# Altium schematic sheet MCU.SchDoc: 分区电源管理电路板-MCU
size A4; Organization: 智能实训室产品部; Address1: 广东省深圳市; Address2: 宝安区石岩凯普达工业园; DocumentNumber: 190416; Revision: V1.0; SheetNumber: 5; SheetTotal: 6; Date: 2019-4-24; ApprovedBy: 杨青; CheckedBy: 杨青; DrawnBy: 杨青; Engineer: 杨青; ProjectName_GTA: 实训室智能化管理系统; PCB Number: GS-P1B-GXO02
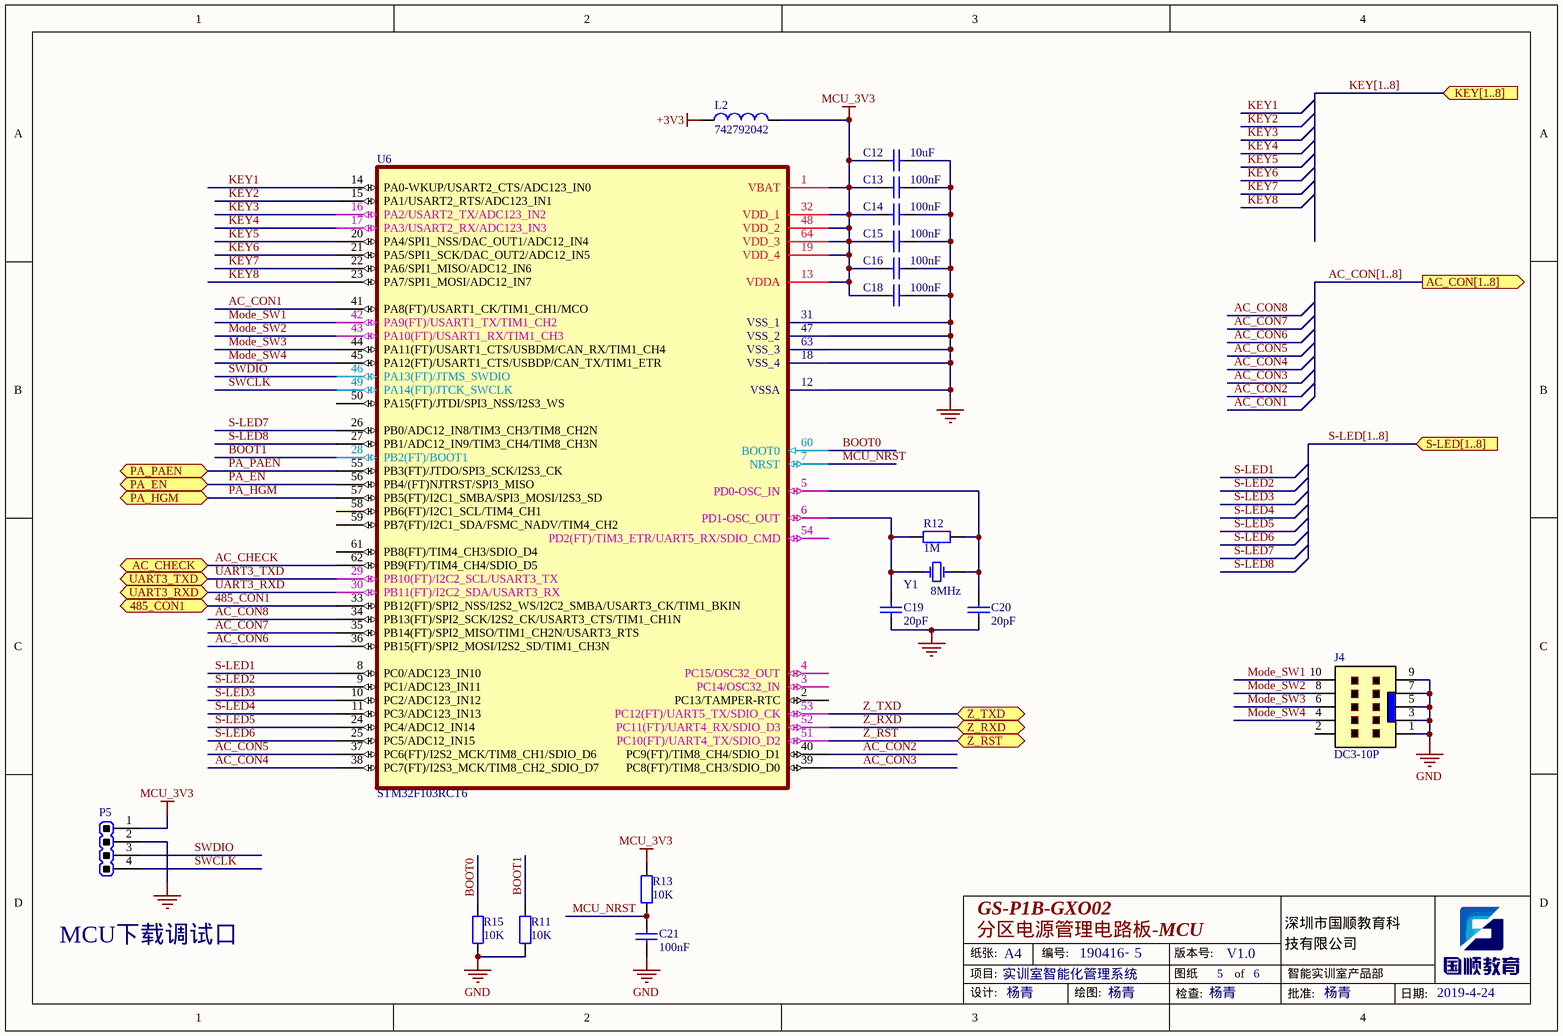
[diagram p0: MCU.SchDoc]

## Parts
C12  10uF  [C0603]
C13  100nF  [C0603]
C14  100nF  [C0603]
C15  100nF  [C0603]
C16  100nF  [C0603]
C18  100nF  [C0603]
C19  20pF  [C0603]
C20  20pF  [C0603]
C21  100nF  [C0603]
J4  DC3-10P  [DC3-2*5-2.54-M]
L2  742792042  [L0805]
P5  HDRM-2.54/11-1*4P-AK  [HDRM-2.54-1*4P-AK1]  (value not drawn)
R11  10K  [R0603]
R12  1M  [R0603]
R13  10K  [R0603]
R15  10K  [R0603]
U6  STM32F103RCT6  [LQFP64]
Y1  8MHz  [X_HC49-S]

## Ports
485_CON1 (bidir), AC_CHECK (bidir), AC_CON[1..8] (out), KEY[1..8] (in), PA_EN (bidir), PA_HGM (bidir), PA_PAEN (bidir), S-LED[1..8] (in), UART3_RXD (bidir), UART3_TXD (bidir), Z_RST (bidir), Z_RXD (bidir), Z_TXD (bidir)

## Nets
+3V3: L2.2
GND: C12.1 C13.2 C14.2 C15.1 C16.1 C18.2 C19.2 C20.2 C21.2 J4.1 J4.3 J4.5 J4.7 J4.9 P5.2 R11.1 R15.1 U6.12(VSSA) U6.18(VSS_4) U6.31(VSS_1) U6.47(VSS_2) U6.63(VSS_3)
MCU_3V3: C12.2 C13.1 C14.1 C15.2 C16.2 C18.1 L2.1 P5.1 R13.2 U6.1(VBAT) U6.13(VDDA) U6.19(VDD_4) U6.32(VDD_1) U6.48(VDD_2) U6.64(VDD_3)
485_CON1: U6.33(PB12(FT)/SPI2_NSS/I2S2_WS/I2C2_SMBA/USART3_CK/TIM1_BKIN) ; port 485_CON1
AC_CHECK: U6.62(PB9(FT)/TIM4_CH4/SDIO_D5) ; port AC_CHECK
AC_CON1: U6.41(PA8(FT)/USART1_CK/TIM1_CH1/MCO)
AC_CON2: U6.40(PC9(FT)/TIM8_CH4/SDIO_D1)
AC_CON3: U6.39(PC8(FT)/TIM8_CH3/SDIO_D0)
AC_CON4: U6.38(PC7(FT)/I2S3_MCK/TIM8_CH2_SDIO_D7)
AC_CON5: U6.37(PC6(FT)/I2S2_MCK/TIM8_CH1/SDIO_D6)
AC_CON6: U6.36(PB15(FT)/SPI2_MOSI/I2S2_SD/TIM1_CH3N)
AC_CON7: U6.35(PB14(FT)/SPI2_MISO/TIM1_CH2N/USART3_RTS)
AC_CON8: U6.34(PB13(FT)/SPI2_SCK/I2S2_CK/USART3_CTS/TIM1_CH1N)
BOOT0: R15.2 U6.60(BOOT0)
BOOT1: R11.2 U6.28(PB2(FT)/BOOT1)
KEY1: U6.14(PA0-WKUP/USART2_CTS/ADC123_IN0)
KEY2: U6.15(PA1/USART2_RTS/ADC123_IN1)
KEY3: U6.16(PA2/USART2_TX/ADC123_IN2)
KEY4: U6.17(PA3/USART2_RX/ADC123_IN3)
KEY5: U6.20(PA4/SPI1_NSS/DAC_OUT1/ADC12_IN4)
KEY6: U6.21(PA5/SPI1_SCK/DAC_OUT2/ADC12_IN5)
KEY7: U6.22(PA6/SPI1_MISO/ADC12_IN6)
KEY8: U6.23(PA7/SPI1_MOSI/ADC12_IN7)
MCU_NRST: C21.1 R13.1 U6.7(NRST)
Mode_SW1: J4.10 U6.42(PA9(FT)/USART1_TX/TIM1_CH2)
Mode_SW2: J4.8 U6.43(PA10(FT)/USART1_RX/TIM1_CH3)
Mode_SW3: J4.6 U6.44(PA11(FT)/USART1_CTS/USBDM/CAN_RX/TIM1_CH4)
Mode_SW4: J4.4 U6.45(PA12(FT)/USART1_CTS/USBDP/CAN_TX/TIM1_ETR)
PA_EN: U6.56(PB4/(FT)NJTRST/SPI3_MISO) ; port PA_EN
PA_HGM: U6.57(PB5(FT)/I2C1_SMBA/SPI3_MOSI/I2S3_SD) ; port PA_HGM
PA_PAEN: U6.55(PB3(FT)/JTDO/SPI3_SCK/I2S3_CK) ; port PA_PAEN
S-LED1: U6.8(PC0/ADC123_IN10)
S-LED2: U6.9(PC1/ADC123_IN11)
S-LED3: U6.10(PC2/ADC123_IN12)
S-LED4: U6.11(PC3/ADC123_IN13)
S-LED5: U6.24(PC4/ADC12_IN14)
S-LED6: U6.25(PC5/ADC12_IN15)
S-LED7: U6.26(PB0/ADC12_IN8/TIM3_CH3/TIM8_CH2N)
S-LED8: U6.27(PB1/ADC12_IN9/TIM3_CH4/TIM8_CH3N)
SWCLK: P5.4 U6.49(PA14(FT)/JTCK_SWCLK)
SWDIO: P5.3 U6.46(PA13(FT)/JTMS_SWDIO)
UART3_RXD: U6.30(PB11(FT)/I2C2_SDA/USART3_RX) ; port UART3_RXD
UART3_TXD: U6.29(PB10(FT)/I2C2_SCL/USART3_TX) ; port UART3_TXD
Z_RST: U6.51(PC10(FT)/UART4_TX/SDIO_D2) ; port Z_RST
Z_RXD: U6.52(PC11(FT)/UART4_RX/SDIO_D3) ; port Z_RXD
Z_TXD: U6.53(PC12(FT)/UART5_TX/SDIO_CK) ; port Z_TXD
NetC19_1: C19.1 R12.1 U6.6(PD1-OSC_OUT) Y1.1
NetC20_1: C20.1 R12.2 U6.5(PD0-OSC_IN) Y1.2

Not connected (* = marked no-connect by the designer): J4 2; U6 2(PC13/TAMPER-RTC) 3(PC14/OSC32_IN) 4(PC15/OSC32_OUT) 50(PA15(FT)/JTDI/SPI3_NSS/I2S3_WS) 54(PD2(FT)/TIM3_ETR/UART5_RX/SDIO_CMD) 58(PB6(FT)/I2C1_SCL/TIM4_CH1) 59(PB7(FT)/I2C1_SDA/FSMC_NADV/TIM4_CH2) 61(PB8(FT)/TIM4_CH3/SDIO_D4)

## Buses and harness runs
bus AC_CON[1..8] = port AC_CON[1..8]
bus KEY[1..8] = port KEY[1..8]
bus S-LED[1..8] = port S-LED[1..8]

## Notes on the sheet
- MCU下载调试口
- 纸张:
- 项目:
- A4
- 编号:
- -
- 版本号:
- 图纸
- of
- 深圳市国顺教育科
- 技有限公司
- 设计:
- 绘图:
- 检查:
- 批准:
- 日期:

## Library data of the parts
C12 = 10uF_16V_0603: Capacitor; 编码: 无; 规格/型号: 10uF,16V,0603; 物料名称: 贴片电容
C13-C16 C18 C21 = 100nF_50V_0603: Capacitor; 编码: 无; 规格/型号: 100nF,50V,0603; 物料名称: 贴片电容
C19 C20 = 20pF_50V_0603: Capacitor; 编码: 无; 规格/型号: 20pF,50V,0603; 物料名称: 贴片电容
J4 = DC3-10P: 编码: 1011701019; 规格/型号: 2.54MM,DC3-10P,2*5P,180°立式直插; 物料名称: 简易牛角座
L2 = BEAD-742792042_0805: 磁珠,WE-CBF,600@100M, / 500Ohm,200mA,0805,742792042; 品牌: WE; 物料名称: 贴片磁珠; 规格/型号: WE-CBF,磁珠,600@100M，500Ohm,200mA,0805,742792042; 单价: 0.04
P5 = HDRM-2.54/11-1*4P-AK: 排针,直; 规格/型号: 排针,间距2.54,针长11mm,1*4P,180°直插; 物料名称: 排针
R11 R13 R15 = 10K_5%_0603: 10K,±5%,0603; 物料名称: 贴片电阻; 单价: 0.02; 规格/型号: 10K,±5%,0603; 参数: ±5%
R12 = 1M_5%_0603: 1M,±5%,0603; 物料名称: 贴片电阻; 单价: 0.02; 规格/型号: 1M,±5%,0603; 参数: ±5%
U6 = STM32F103RCT6-LQFP64_1: ARM Cortex-M3 32-bit MCU, 256 KB Flash, 48 KB Internal RAM, 51 I/Os, 64-pin LQFP, -40 to 85 degC, Tray; 物料名称: 贴片芯片; 编码: 1010501255; 规格/型号: STM32F103RCT6,LQFP64
Y1 = CRYSTAL_8M_HC49S: 8MHz,HC-49S; 编码: 1011201001; 规格/型号: 8MHz,HC-49S,插针式; 物料名称: 直插无源晶振